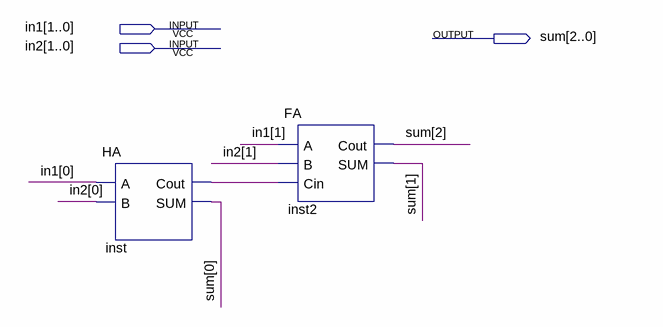
[diagram p0: schematic sheet]
// Quartus schematic 2bit_RCA.bdf as structural Verilog: 2 symbols, 3 pins
module \2bit_RCA  (
  input  [1:0] in1,
  input  [1:0] in2,
  output [2:0] sum
);

  wire inst_cout;

  HA inst (.A(in1[0]), .B(in2[0]), .Cout(inst_cout), .SUM(sum[0]));
  FA inst2 (.A(in1[1]), .B(in2[1]), .Cin(inst_cout), .Cout(sum[2]), .SUM(sum[1]));
endmodule
